# Altium schematic sheet Capteur.SchDoc: Capteur température et courant
size A4; DrawnBy: Alves Adam; Revision: V0.1 Rev A; SheetNumber: 1; SheetTotal: 9
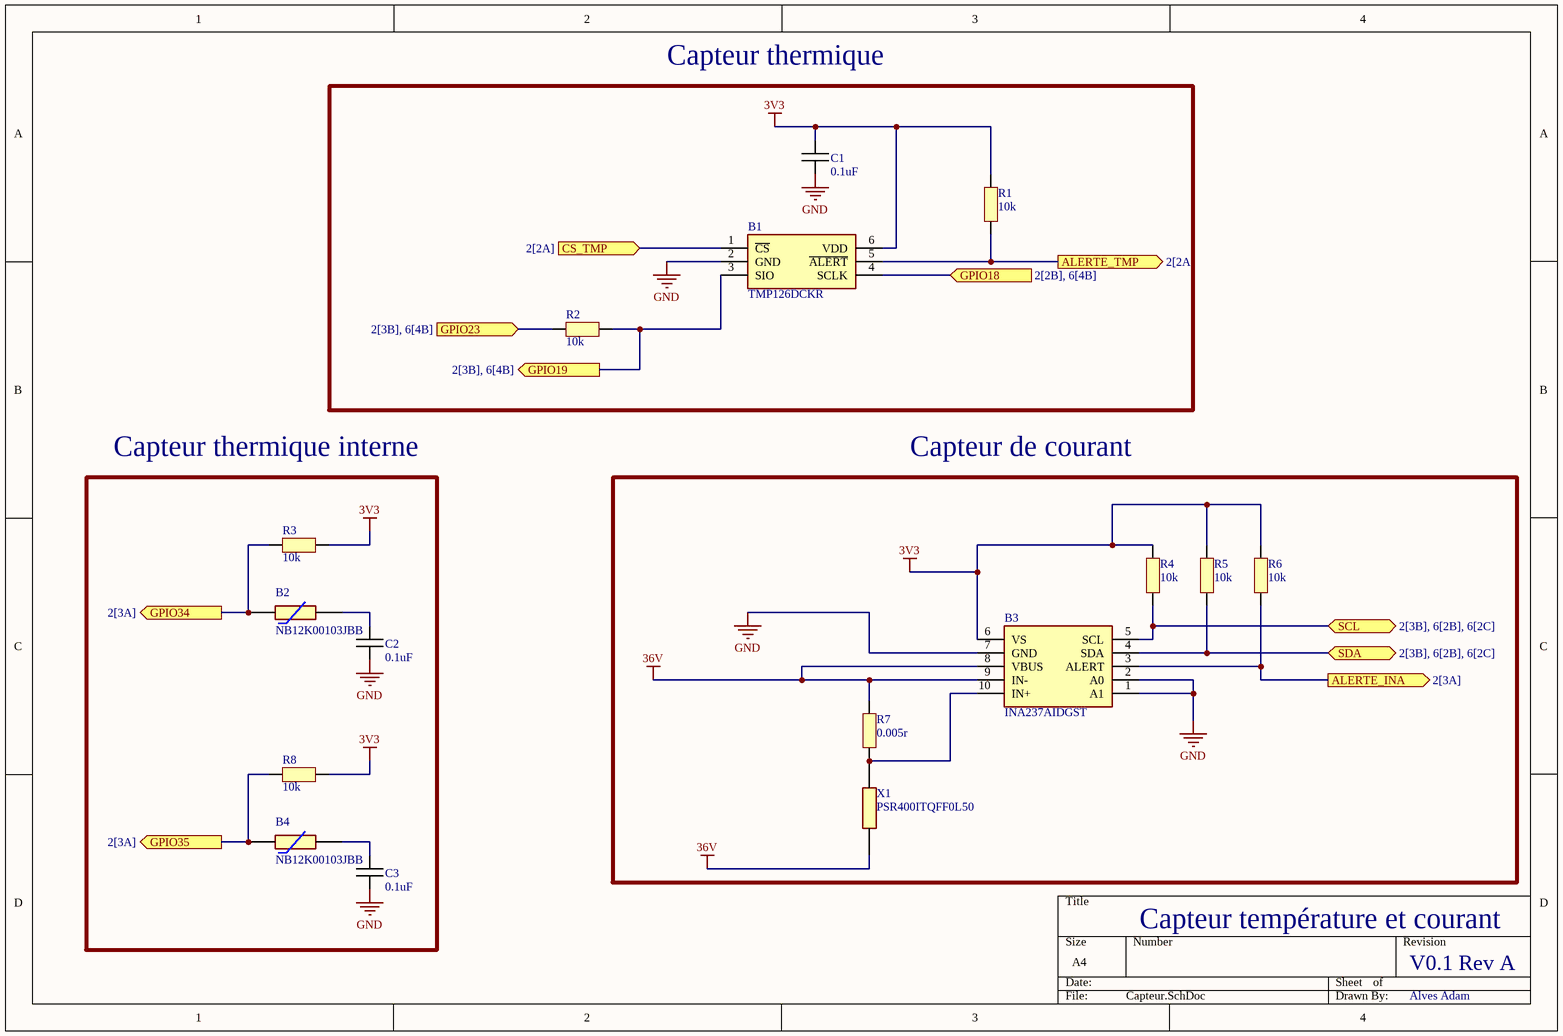
[diagram p0: Capteur.SchDoc]

## Parts
B1  TMP126DCKR  [SOT65P210X110-6N]
B2  NB12K00103JBB  [RESC2212X50N]
B3  INA237AIDGST  [SOP50P490X110-10N]
B4  NB12K00103JBB  [RESC2212X50N]
C1  0.1uF  [CAPC1005X06N]
C2  0.1uF  [CAPC1005X06N]
C3  0.1uF  [CAPC1005X06N]
R1  10k  [RESC1005X06N]
R2  10k  [RESC1005X06N]
R3  10k  [RESC1005X06N]
R4  10k  [RESC1005X06N]
R5  10k  [RESC1005X06N]
R6  10k  [RESC1005X06N]
R7  0.005r  [RESC1005X06N]
R8  10k  [RESC1005X06N]
X1  PSR400ITQFF0L50  [RESC10052X200N]

## Blocks framed on the sheet
Capteur thermique: B1 C1 R1 R2
Capteur thermique interne: B2 B4 C2 C3 R3 R8
Capteur de courant: B3 R4-R7 X1

## Ports
ALERTE_INA (out, see 2[3A]), ALERTE_TMP (out, see 2[2A]), CS_TMP (in, see 2[2A]), GPIO18 (in, see 2[2B], 6[4B]), GPIO19 (out, see 2[3B], 6[4B]), GPIO23 (in, see 2[3B], 6[4B]), GPIO34 (out, see 2[3A]), GPIO35 (out, see 2[3A]), SCL (bidir, see 2[3B], 6[2B], 6[2C]), SDA (bidir, see 2[3B], 6[2B], 6[2C])

## Nets
3V3: B1.6(VDD) B3.6(VS) C1.1 R1.1 R3.2 R4.2 R5.2 R6.2 R8.2
36V: B3.8(VBUS) B3.9(IN-) R7.2 X1.1
GND: B1.2(GND) B3.1(A1) B3.2(A0) B3.7(GND) C1.2 C2.2 C3.2
ALERTE_INA: B3.3(ALERT) R6.1 ; port ALERTE_INA
ALERTE_TMP: B1.5(~{ALERT}) R1.2 ; port ALERTE_TMP
CS_TMP: B1.1(~{CS}) ; port CS_TMP
GPIO18: B1.4(SCLK) ; port GPIO18
GPIO19: B1.3(SIO) R2.2 ; port GPIO19
GPIO23: R2.1 ; port GPIO23
GPIO34: B2.1 R3.1 ; port GPIO34
GPIO35: B4.1 R8.1 ; port GPIO35
SCL: B3.5(SCL) R4.1 ; port SCL
SDA: B3.4(SDA) R5.1 ; port SDA
NetB2_2: B2.2 C2.1
NetB3_10: B3.10(IN+) R7.1 X1.2
NetB4_2: B4.2 C3.1

## Library data of the parts
B1 = TMP126DCKR: Board Mount Temperature Sensors +/-0.25 C SPI temperature sensor with 175 C operation, CRC and slew-rate alert; Manufacturer_Name: Texas Instruments; Manufacturer_Part_Number: TMP126DCKR; Mouser Part Number: 595-TMP126DCKR
B2 B4 = NB12K00103JBB: NTC SMD Thermistor, NB12K, 10K, 5% AVX 10k 0805 Protection NTC Thermistor, 5s, 2 x 1.25 x 1.3mm; Manufacturer_Name: Kyocera AVX; Geometry.Height: 0.5mm; Manufacturer_Part_Number: NB12K00103JBB; Mouser Part Number: 581-NB12K00103JBB; Mouser Price/Stock: https://www.mouser.co.uk/ProductDetail/AVX/NB12K00103JBB/?qs=4%252B6%252BTdINQeDPvI%252BQUQjJ3Q%3D%3D; Arrow Part Number: NB12K00103JBB; Arrow Price/Stock: https://www.arrow.com/en/products/nb12k00103jbb/avx; Datasheet Link: https://datasheet.datasheetarchive.com/originals/distributors/Datasheets-DGA6/551314.pdf
B3 = INA237AIDGST: Current Sense Amplifiers 85-V, 16-bit, I2C output current/voltage/power monitor with alert 10-VSSOP -40 to 125; Manufacturer_Name: Texas Instruments; Manufacturer_Part_Number: INA237AIDGST; Mouser Part Number: 595-INA237AIDGST
C1-C3 = Capacitor
R1-R8 = Resistor
X1 = PSR400ITQFF0L50: ROHM - PSR400ITQFF0L50 - SMD Current Sense Resistor, 500 ohm, PSR Series, 3921 [1052 Metric], 4 W, +/- 1%, Metal Strip; Manufacturer_Name: ROHM Semiconductor; Geometry.Height: 2mm; Manufacturer_Part_Number: PSR400ITQFF0L50; Mouser Part Number: 755-PSR400ITQFF0L50; Mouser Price/Stock: https://www.mouser.co.uk/ProductDetail/ROHM-Semiconductor/PSR400ITQFF0L50?qs=493kPxzlxfLaT1w5Mo%252BtHg%3D%3D; Arrow Part Number: *; Arrow Price/Stock: *; Datasheet Link: https://componentsearchengine.com/Datasheets/2/PSR400ITQFF0L50.pdf